# Altium schematic sheet GPS.SchDoc: GPS
size 420 x 297 mm; DocumentNumber: 7; SheetNumber: 7; SheetTotal: 8
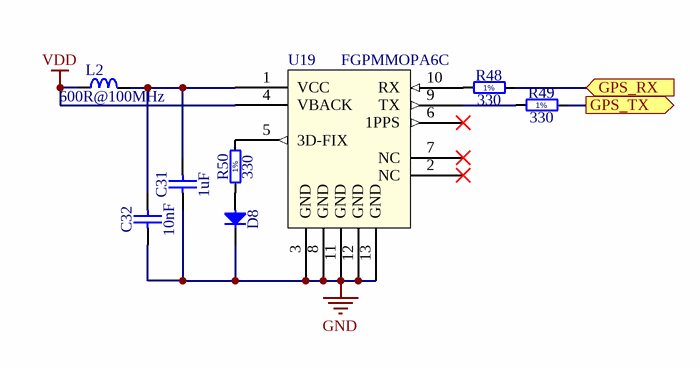
[diagram p0: GPS.SchDoc]

## Parts
C31  1uF  [CAPC1608X87N]
C32  10nF  [CAPC1608X87N]
D8  (no value)  [LED_DIODE_0603]
L2  600R@100MHz  [INDC1005X55N]
R48  330  [RESC1608X55N]
R49  330  [RESC1608X55N]
R50  330  [RESC1608X55N]
U19  FGPMMOPA6C  [GPS-FGPMMOPA6C]

## Ports
GPS_RX (in), GPS_TX (out)

## Nets
GND: C31.1 C32.1 D8.1(C) U19.3(GND) U19.8(GND) U19.11(GND) U19.12(GND) U19.13(GND)
VDD: L2.1 U19.4(VBACK)
GPS_RX: R48.2 ; port GPS_RX
GPS_TX: R49.2 ; port GPS_TX
NetC31_2: C31.2 C32.2 L2.2 U19.1(VCC)
NetD8_2: D8.2(A) R50.1
NetR48_1: R48.1 U19.10(RX)
NetR49_1: R49.1 U19.9(TX)
NetR50_2: R50.2 U19.5(3D-FIX)

Not connected (* = marked no-connect by the designer): U19 2(NC)* 6(1PPS)* 7(NC)*

## Notes on the sheet
- Project/Equipment
- Document
- Sensorbox
- Designer
- Drawn by
- Check.by
- Copyright Creotech Instruments SA 2014.
  This documentation describes Open Hardware and is licensed under the CERN OHL v.1.1. You may redistribute and modify this documentation under the terms of the CERN OHL v.1.1. (http://ohwr.org/CERNOHL). This documentation is distributed WITHOUT ANY EXPRESS OR IMPLIED WARRANTY, INCLUDING OF MERCHANTABILITY, SATISFACTORY QUALITY AND FITNESS FOR A PARTICULAR PURPOSE. Please see the CERN OHL v.1.1 for applicable conditions.
- CTI
- Creotech Instruments S.A.
- File
- Last Mod.
- Print Date
- Sheet
- Size
- A3
- of
- Rev
- (in symbol R0603_330R_1%_0.1W_100PPM) 1%

## Library data of the parts
C31 = CC0603_1UF_16V_10%_X7R: Non-polarised capacitor; Part Description: SMD Multilayer Chip Ceramic Capacitor; Manufacturer: GENERIC; Manufacturer1 Part Number: 223824613663; Voltage: 16V; TC: X7R; Tolerance: ±10%; Table: Capacitors SMD; Part Number: CC0603_1UF_16V_10%_X7R; Component Kind: Standard; Component Type: Standard; Pin Count: 2; Value: 1uF; Status: Preferred; Manufacturer Part Number: CC0603_1uF_16V_10%_X7R; Case: 0603; Mounted: Yes; Socket: No; SMD: Yes; Manufacturer1 Example: PHYCOMP; Manufacturer1 ComponentHeight: 0.87mm; HelpURL: \\cern.ch\dfs\Applications\Altium\Datasheets\CC0805_X5R_PHYCOMP_HC.pdf; Author: CERN DEM JLC; CreateDate: 2007-12-03; LatestRevisionDate: 2007-12-03
C32 = CC0603_10NF_50V_10%_X7R: Non-polarised capacitor; Part Description: SMD Multilayer Chip Ceramic Capacitor; Manufacturer: GENERIC; Manufacturer1 Part Number: 223858615636; Voltage: 50V; TC: X7R; Tolerance: ±10%; Table: Capacitors SMD; Part Number: CC0603_10NF_50V_10%_X7R; Component Kind: Standard; Component Type: Standard; Pin Count: 2; Value: 10nF; Status: Preferred; Manufacturer Part Number: CC0603_10NF_50V_10%_X7R; Case: 0603; Mounted: Yes; Socket: No; SMD: Yes; Manufacturer1 Example: PHYCOMP; Manufacturer1 ComponentHeight: 0.87mm; HelpURL: \\cern.ch\dfs\Applications\Altium\Datasheets\CC0603_X7R_PHYCOMP.pdf; Author: CERN DEM JLC; CreateDate: 2007-12-03; LatestRevisionDate: 2007-12-03
D8 = Diode
L2 = IND0402_MURATA_BLM15HB221SN1: Inductor; Part Number: MLB-100505-0600A; Part Description: SMD EMIFIL Suppression Chip Bead Ferrite; Manufacturer: MLB; Power: 200mA; Resistance: 1R; Tolerance: ±25%; Table: Inductors SMD; Component Kind: Standard; Component Type: Standard; Pin Count: 2; Value: 600R@100MHz; Status: None; Manufacturer Part Number: MLB-100505-0600A; Case: 0402; Mounted: Yes; Socket: No; SMD: Yes; ComponentHeight: 0.55mm; HelpURL: \\cern.ch\dfs\Applications\Altium\Datasheets\IND0402_MURATA_BLM15H.pdf; Author: CERN DEM JLC; CreateDate: 2009-06-23; LatestRevisionDate: 2009-06-23
R48-R50 = R0603_330R_1%_0.1W_100PPM: Resistor - 1%; Part Description: General Purpose Thick Film Chip Resistor; Manufacturer: GENERIC; Manufacturer1 Part Number: NRC06F3300TRF; Power: 0.1W; TC: ±100ppm/°C; Table: Resistors SMD; Part Number: R0603_330R_1%_0.1W_100PPM; Component Kind: Standard; Component Type: Standard; Pin Count: 2; Value: 330; Status: Preferred; Tolerance: ±1%; Manufacturer Part Number: R0603_330R_1%_0.1W_100PPM; Case: 0603; Mounted: Yes; Socket: No; SMD: Yes; Manufacturer1 Example: NIC COMPONENT; Manufacturer1 ComponentHeight: 0.55mm; HelpURL: \\cern.ch\dfs\Applications\Altium\Datasheets\R0603_NIC_NRC.pdf; Author: CERN DEM JLC; CreateDate: 2007-12-03; LatestRevisionDate: 2008-03-13
U19 = FGPMMOPA6C - GPS MODULE